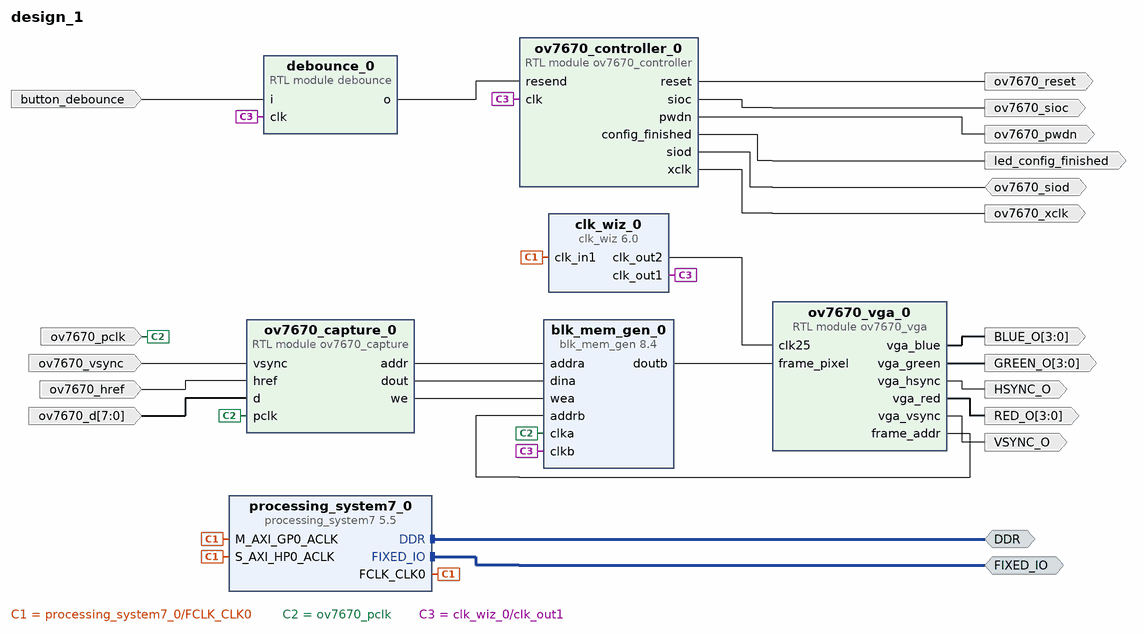
[diagram p0: block diagram of the top level]
# Vivado block design design_1, xc7z020clg400-1, Vivado 2019.1
create_bd_design design_1

create_bd_intf_port -mode Master -vlnv xilinx.com:interface:ddrx_rtl:1.0 DDR
create_bd_intf_port -mode Master -vlnv xilinx.com:display_processing_system7:fixedio_rtl:1.0 FIXED_IO
create_bd_port -dir I ov7670_pclk
create_bd_port -dir I ov7670_vsync
create_bd_port -dir I ov7670_href
create_bd_port -dir I -from 7 -to 0 ov7670_d
create_bd_port -dir O HSYNC_O
create_bd_port -dir O VSYNC_O
create_bd_port -dir O ov7670_sioc
create_bd_port -dir O -type rst ov7670_reset
create_bd_port -dir IO ov7670_siod
create_bd_port -dir O ov7670_pwdn
create_bd_port -dir O ov7670_xclk
create_bd_port -dir I button_debounce
create_bd_port -dir O led_config_finished
create_bd_port -dir O -from 3 -to 0 RED_O
create_bd_port -dir O -from 3 -to 0 GREEN_O
create_bd_port -dir O -from 3 -to 0 BLUE_O

create_bd_cell -type ip -vlnv xilinx.com:ip:processing_system7:5.5 processing_system7_0
set_property -dict [list \
  CONFIG.PCW_APU_PERIPHERAL_FREQMHZ 666.666666 \
  CONFIG.PCW_CAN0_CAN0_IO {MIO 14 .. 15} \
  CONFIG.PCW_CAN0_PERIPHERAL_ENABLE 1 \
  CONFIG.PCW_ENET0_ENET0_IO {MIO 16 .. 27} \
  CONFIG.PCW_ENET0_GRP_MDIO_ENABLE 1 \
  CONFIG.PCW_ENET0_GRP_MDIO_IO {MIO 52 .. 53} \
  CONFIG.PCW_ENET0_PERIPHERAL_CLKSRC {ARM PLL} \
  CONFIG.PCW_ENET0_PERIPHERAL_ENABLE 1 \
  CONFIG.PCW_ENET0_RESET_ENABLE 0 \
  CONFIG.PCW_ENET_RESET_ENABLE 1 \
  CONFIG.PCW_ENET_RESET_SELECT {Share reset pin} \
  CONFIG.PCW_EN_CLK1_PORT 1 \
  CONFIG.PCW_FCLK_CLK1_BUF TRUE \
  CONFIG.PCW_FPGA0_PERIPHERAL_FREQMHZ 100 \
  CONFIG.PCW_FPGA1_PERIPHERAL_FREQMHZ 50 \
  CONFIG.PCW_FPGA_FCLK1_ENABLE 1 \
  CONFIG.PCW_GPIO_MIO_GPIO_ENABLE 1 \
  CONFIG.PCW_GPIO_MIO_GPIO_IO MIO \
  CONFIG.PCW_GPIO_PERIPHERAL_ENABLE 1 \
  CONFIG.PCW_I2C0_I2C0_IO EMIO \
  CONFIG.PCW_I2C0_PERIPHERAL_ENABLE 1 \
  CONFIG.PCW_I2C1_I2C1_IO {MIO 12 .. 13} \
  CONFIG.PCW_I2C1_PERIPHERAL_ENABLE 1 \
  CONFIG.PCW_I2C_PERIPHERAL_FREQMHZ 83.333336 \
  CONFIG.PCW_I2C_RESET_ENABLE 1 \
  CONFIG.PCW_I2C_RESET_SELECT {Share reset pin} \
  CONFIG.PCW_PRESET_BANK1_VOLTAGE {LVCMOS 1.8V} \
  CONFIG.PCW_QSPI_GRP_FBCLK_ENABLE 1 \
  CONFIG.PCW_QSPI_GRP_FBCLK_IO {MIO 8} \
  CONFIG.PCW_QSPI_GRP_SINGLE_SS_ENABLE 1 \
  CONFIG.PCW_QSPI_GRP_SINGLE_SS_IO {MIO 1 .. 6} \
  CONFIG.PCW_QSPI_PERIPHERAL_ENABLE 1 \
  CONFIG.PCW_QSPI_PERIPHERAL_FREQMHZ 200.000000 \
  CONFIG.PCW_QSPI_QSPI_IO {MIO 1 .. 6} \
  CONFIG.PCW_SD0_GRP_CD_ENABLE 1 \
  CONFIG.PCW_SD0_GRP_CD_IO {MIO 46} \
  CONFIG.PCW_SD0_GRP_WP_ENABLE 1 \
  CONFIG.PCW_SD0_GRP_WP_IO {MIO 47} \
  CONFIG.PCW_SD0_PERIPHERAL_ENABLE 1 \
  CONFIG.PCW_SD0_SD0_IO {MIO 40 .. 45} \
  CONFIG.PCW_SDIO_PERIPHERAL_FREQMHZ 100 \
  CONFIG.PCW_SINGLE_QSPI_DATA_MODE x4 \
  CONFIG.PCW_TTC0_PERIPHERAL_ENABLE 1 \
  CONFIG.PCW_TTC0_TTC0_IO EMIO \
  CONFIG.PCW_UART1_PERIPHERAL_ENABLE 1 \
  CONFIG.PCW_UART1_UART1_IO {MIO 48 .. 49} \
  CONFIG.PCW_UART_PERIPHERAL_FREQMHZ 100 \
  CONFIG.PCW_UIPARAM_DDR_PARTNO {MT41J256M16 RE-125} \
  CONFIG.PCW_USB0_PERIPHERAL_ENABLE 1 \
  CONFIG.PCW_USB0_RESET_ENABLE 1 \
  CONFIG.PCW_USB0_RESET_IO {MIO 51} \
  CONFIG.PCW_USB0_USB0_IO {MIO 28 .. 39} \
  CONFIG.PCW_USB_RESET_ENABLE 1 \
  CONFIG.PCW_USB_RESET_SELECT {Share reset pin} \
  CONFIG.PCW_USE_S_AXI_HP0 1 \
] [get_bd_cells processing_system7_0]
# 282 more settings of processing_system7_0 are not shown: defaults, MIO pin electricals, DDR timing, and values the tool derives
create_bd_cell -type module -reference ov7670_controller ov7670_controller_0
create_bd_cell -type module -reference ov7670_capture ov7670_capture_0
create_bd_cell -type ip -vlnv xilinx.com:ip:clk_wiz:6.0 clk_wiz_0
set_property -dict [list \
  CONFIG.CLKOUT1_JITTER 151.636 \
  CONFIG.CLKOUT1_REQUESTED_OUT_FREQ 50 \
  CONFIG.CLKOUT2_JITTER 175.402 \
  CONFIG.CLKOUT2_PHASE_ERROR 98.575 \
  CONFIG.CLKOUT2_REQUESTED_OUT_FREQ 25 \
  CONFIG.CLKOUT2_USED true \
  CONFIG.MMCM_CLKOUT0_DIVIDE_F 20.000 \
  CONFIG.MMCM_CLKOUT1_DIVIDE 40 \
  CONFIG.NUM_OUT_CLKS 2 \
] [get_bd_cells clk_wiz_0]
create_bd_cell -type module -reference debounce debounce_0
create_bd_cell -type ip -vlnv xilinx.com:ip:blk_mem_gen:8.4 blk_mem_gen_0
set_property -dict [list \
  CONFIG.Enable_32bit_Address false \
  CONFIG.Enable_A Always_Enabled \
  CONFIG.Enable_B Always_Enabled \
  CONFIG.Memory_Type Simple_Dual_Port_RAM \
  CONFIG.Operating_Mode_A NO_CHANGE \
  CONFIG.Port_B_Clock 100 \
  CONFIG.Port_B_Enable_Rate 100 \
  CONFIG.Read_Width_B 12 \
  CONFIG.Register_PortB_Output_of_Memory_Primitives true \
  CONFIG.Use_Byte_Write_Enable false \
  CONFIG.Write_Depth_A 153600 \
  CONFIG.Write_Width_A 12 \
  CONFIG.Write_Width_B 12 \
  CONFIG.use_bram_block Stand_Alone \
] [get_bd_cells blk_mem_gen_0]
create_bd_cell -type module -reference ov7670_vga ov7670_vga_0

# ---- connections ----

connect_bd_intf_net [get_bd_intf_ports DDR] [get_bd_intf_pins processing_system7_0/DDR]
connect_bd_intf_net [get_bd_intf_ports FIXED_IO] [get_bd_intf_pins processing_system7_0/FIXED_IO]
connect_bd_net [get_bd_pins processing_system7_0/FCLK_CLK0] \
  [get_bd_pins processing_system7_0/M_AXI_GP0_ACLK] [get_bd_pins processing_system7_0/S_AXI_HP0_ACLK] \
  [get_bd_pins clk_wiz_0/clk_in1]
connect_bd_net -net pclk_0_1 [get_bd_ports ov7670_pclk] [get_bd_pins ov7670_capture_0/pclk] [get_bd_pins blk_mem_gen_0/clka]
connect_bd_net -net vsync_0_1 [get_bd_ports ov7670_vsync] [get_bd_pins ov7670_capture_0/vsync]
connect_bd_net -net href_0_1 [get_bd_ports ov7670_href] [get_bd_pins ov7670_capture_0/href]
connect_bd_net -net d_0_1 [get_bd_ports ov7670_d] [get_bd_pins ov7670_capture_0/d]
connect_bd_net [get_bd_pins ov7670_vga_0/vga_hsync] [get_bd_ports HSYNC_O]
connect_bd_net [get_bd_pins ov7670_controller_0/sioc] [get_bd_ports ov7670_sioc]
connect_bd_net [get_bd_pins ov7670_controller_0/reset] [get_bd_ports ov7670_reset]
connect_bd_net [get_bd_ports ov7670_siod] [get_bd_pins ov7670_controller_0/siod]
connect_bd_net [get_bd_pins ov7670_controller_0/pwdn] [get_bd_ports ov7670_pwdn]
connect_bd_net [get_bd_pins ov7670_controller_0/xclk] [get_bd_ports ov7670_xclk]
connect_bd_net [get_bd_pins clk_wiz_0/clk_out1] [get_bd_pins ov7670_controller_0/clk] [get_bd_pins blk_mem_gen_0/clkb] [get_bd_pins debounce_0/clk]
connect_bd_net [get_bd_pins clk_wiz_0/clk_out2] [get_bd_pins ov7670_vga_0/clk25]
connect_bd_net [get_bd_pins blk_mem_gen_0/doutb] [get_bd_pins ov7670_vga_0/frame_pixel]
connect_bd_net [get_bd_pins ov7670_capture_0/addr] [get_bd_pins blk_mem_gen_0/addra]
connect_bd_net [get_bd_pins ov7670_capture_0/dout] [get_bd_pins blk_mem_gen_0/dina]
connect_bd_net [get_bd_pins ov7670_capture_0/we] [get_bd_pins blk_mem_gen_0/wea]
connect_bd_net [get_bd_pins debounce_0/o] [get_bd_pins ov7670_controller_0/resend]
connect_bd_net -net i_0_1 [get_bd_ports button_debounce] [get_bd_pins debounce_0/i]
connect_bd_net [get_bd_pins ov7670_vga_0/vga_vsync] [get_bd_ports VSYNC_O]
connect_bd_net [get_bd_pins ov7670_vga_0/frame_addr] [get_bd_pins blk_mem_gen_0/addrb]
connect_bd_net [get_bd_pins ov7670_controller_0/config_finished] [get_bd_ports led_config_finished]
connect_bd_net [get_bd_pins ov7670_vga_0/vga_red] [get_bd_ports RED_O]
connect_bd_net [get_bd_pins ov7670_vga_0/vga_green] [get_bd_ports GREEN_O]
connect_bd_net [get_bd_pins ov7670_vga_0/vga_blue] [get_bd_ports BLUE_O]

validate_bd_design
save_bd_design
